# Altium project ADC.PrjPcb
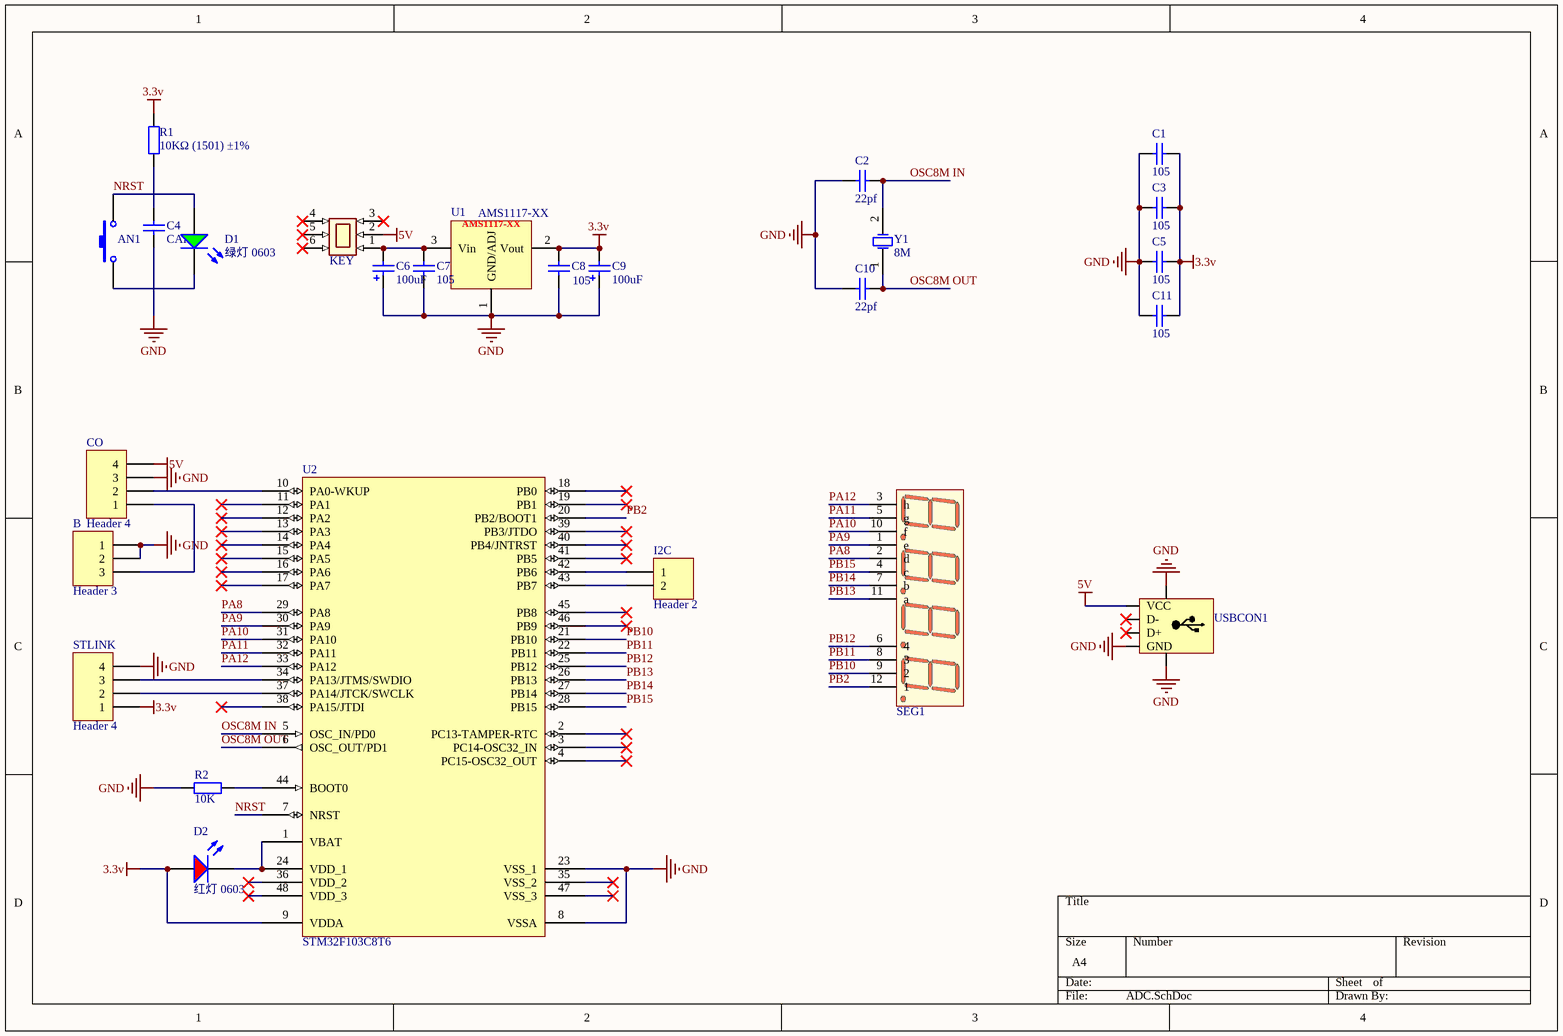
[diagram p0: ADC.SchDoc]
1 sheet, 26 parts. Net scope: global (net labels, ports and power ports of the same name join across sheets).
Board file: ADC.PcbDoc

## Sheet ADC.SchDoc
size A4

### Parts
AN1  Button  [BUTTON-DIP]  (value not drawn)
B  Header 3  [HDR1X3]
C1  value 105  [C0603]  (hidden comment: Cap Chip 0603)
C2  value 22pf  [C0603]  (hidden comment: Cap Chip 0603)
C3  value 105  [C0603]  (hidden comment: Cap Chip 0603)
C4  value CAP  [C0603]  (hidden comment: Cap Chip 0603)
C5  value 105  [C0603]  (hidden comment: Cap Chip 0603)
C6  value 100uF  [CAPPR2.5-6.3X11]  (hidden comment: Cap Pol 2.5x6.3)
C7  value 105  [C0603]  (hidden comment: Cap Chip 0603)
C8  value 105  [C0603]  (hidden comment: Cap Chip 0603)
C9  value 100uF  [CAPPR2.5-6.3X11]  (hidden comment: Cap Pol 2.5x6.3)
C10  value 22pf  [C0603]  (hidden comment: Cap Chip 0603)
C11  value 105  [C0603]  (hidden comment: Cap Chip 0603)
CO  Header 4  [HDR1X4]
D1  绿灯 0603  [LC-0603_LED_S1]
D2  红灯 0603  [LC-0603_LED_S1]
I2C  Header 2  [HDR1X2]
KEY  开关(锁存开关）  [开关(锁存开关）]  (value not drawn)
R1  10KΩ (1501) ±1%  [LC-0402_R]
R2  value 10K  [R0603]  (hidden comment: Resistor Chip 0603)
SEG1  R-G-B  [4-SEGMENTS]  (value not drawn)
STLINK  Header 4  [HDR1X4]
U1  AMS1117-XX  [SOT-223-4]
U2  STM32F103C8T6  [LQFP48_N]
USBCON1  USB-4P  [USB-A]  (value not drawn)
Y1  8M  [LC-SMD-5032_2P]

### Nets
3.3v: C1.2 C3.2 C5.2 C8.2 C9.2 C11.2 D2.A R1.2 STLINK.1 U1.2(Vout) U2.9(VDDA)
5V: CO.4 KEY.2 USBCON1.1(VCC)
GND: B.1 B.2 C1.1 C2.1 C3.1 C4.1 C5.1 C6.1 C7.1 C8.1 C9.1 C10.1 C11.1 CO.3 R2.1 STLINK.4 U1.1(GND/ADJ) U2.8(VSSA) U2.23(VSS_1) USBCON1.4(GND) USBCON1.5(GND) USBCON1.6(GND)
NRST: AN1.1 D1.A U2.7(NRST)
OSC8M IN: C2.2 U2.5(OSC_IN/PD0) Y1.2(OSC2)
OSC8M OUT: C10.2 U2.6(OSC_OUT/PD1) Y1.1(OSC1)
PA8: SEG1.2(d) U2.29(PA8)
PA9: SEG1.1(e) U2.30(PA9)
PA10: SEG1.10(f) U2.31(PA10)
PA11: SEG1.5(g) U2.32(PA11)
PA12: SEG1.3(h) U2.33(PA12)
PB2: SEG1.12(1) U2.20(PB2/BOOT1)
PB10: SEG1.9(2) U2.21(PB10)
PB11: SEG1.8(3) U2.22(PB11)
PB12: SEG1.6(4) U2.25(PB12)
PB13: SEG1.11(a) U2.26(PB13)
PB14: SEG1.7(b) U2.27(PB14)
PB15: SEG1.4(c) U2.28(PB15)
NetAN1_2: AN1.2 D1.K
NetB_3: B.3 CO.1
NetC4_2: C4.2 R1.1
NetC6_2: C6.2 C7.2 KEY.1 U1.3(Vin)
NetCO_2: CO.2 U2.10(PA0-WKUP)
NetD2_K: D2.K U2.1(VBAT) U2.24(VDD_1)
NetI2C_1: I2C.1 U2.42(PB6)
NetI2C_2: I2C.2 U2.43(PB7)
NetR2_2: R2.2 U2.44(BOOT0)
NetSTLINK_2: STLINK.2 U2.37(PA14/JTCK/SWCLK)
NetSTLINK_3: STLINK.3 U2.34(PA13/JTMS/SWDIO)

Not connected (* = marked no-connect by the designer): KEY 3* 4* 5* 6*; U2 2(PC13-TAMPER-RTC)* 3(PC14-OSC32_IN)* 4(PC15-OSC32_OUT)* 11(PA1)* 12(PA2)* 13(PA3)* 14(PA4)* 15(PA5)* 16(PA6)* 17(PA7)* 18(PB0)* 19(PB1)* 35(VSS_2)* 36(VDD_2)* 38(PA15/JTDI)* 39(PB3/JTDO)* 40(PB4/JNTRST)* 41(PB5)* 45(PB8)* 46(PB9)* 47(VSS_3)* 48(VDD_3)*; USBCON1 2(D-)* 3(D+)*

### Library data of the parts
B = Header 3: Header, 3-Pin; LatestRevisionDate: 17-Jul-2002; LatestRevisionNote: Re-released for DXP Platform.; Publisher: Altium Limited
C1-C5 C7 C8 C10 C11 = Cap Chip 0603: Polarized Capacitor (Radial); Published: 8-Jun-2000; Revision: July-2002: Re-released for DXP Platform.; Publisher: Altium Limited
C6 C9 = Cap Pol 2.5x6.3: Polarized Capacitor (Radial); Published: 8-Jun-2000; Revision: July-2002: Re-released for DXP Platform.; Publisher: Altium Limited
CO STLINK = Header 4: Header, 4-Pin; LatestRevisionDate: 17-Jul-2002; LatestRevisionNote: Re-released for DXP Platform.; Publisher: Altium Limited
D1 = 0603 绿灯: 发光二极管; ComponentLink1Description: 供应商链接; ComponentLink1URL: http://www.szlcsc.com/product/details_73152.html; Package: 0603; Supplier: LC; SuppliersPartNumber: C72043
D2 = 0603 红灯: 发光二极管; ComponentLink1Description: 供应商链接; ComponentLink1URL: http://www.szlcsc.com/product/details_2659.html; Package: 0603; Supplier: LC; SuppliersPartNumber: C2286
I2C = Header 2: Header, 2-Pin; LatestRevisionDate: 17-Jul-2002; LatestRevisionNote: Re-released for DXP Platform.; Publisher: Altium Limited
R1 = 0402 1.5KΩ (1501) 1%: 贴片电阻; ComponentLink1Description: 供应商链接; ComponentLink1URL: http://www.szlcsc.com/product/details_26610.html; Package: 0402; Supplier: LC; SuppliersPartNumber: C25867
R2 = Resistor Chip 0603: Resistor; Published: 8-Jun-2000; Revision: July-2002: Re-released for DXP Platform.; Publisher: Altium Limited
SEG1 = 4-SEGMENTS: 4-BIT-SEGMENTS
U1 = AMS1117-XX: AMS   800mA LOW DROPOUT VOLTAGE REGULATOR
U2 = STM32F103C8T6: STM32 ARM-based 32-bit MCU with 64 Kbytes Flash, 48-pin LQFP, Industrial Temperature; Published: *; DatasheetVersion: *; PackageVersion: *; PackageReference: *; Publisher: *; PackageDescription: *; ComponentLink1Description: *; ComponentLink1URL: *; ComponentLink2Description: *; ComponentLink2URL: *
USBCON1 = USB-4P: USB CONNECTOR
Y1 = SMD-5032_2P 8MHz 20ppm 20pF: 贴片晶振; ComponentLink1Description: 供应商链接; ComponentLink1URL: http://www.szlcsc.com/product/details_19261.html; Package: SMD-5032_2P; Supplier: LC; SuppliersPartNumber: C18560
AN1 = Button: Published: 24-Mar-1999; LatestRevisionDate: 17-Jul-2002; LatestRevisionNote: Re-released for DXP Platform.; PackageReference: SPST-2; Publisher: Altium Limited